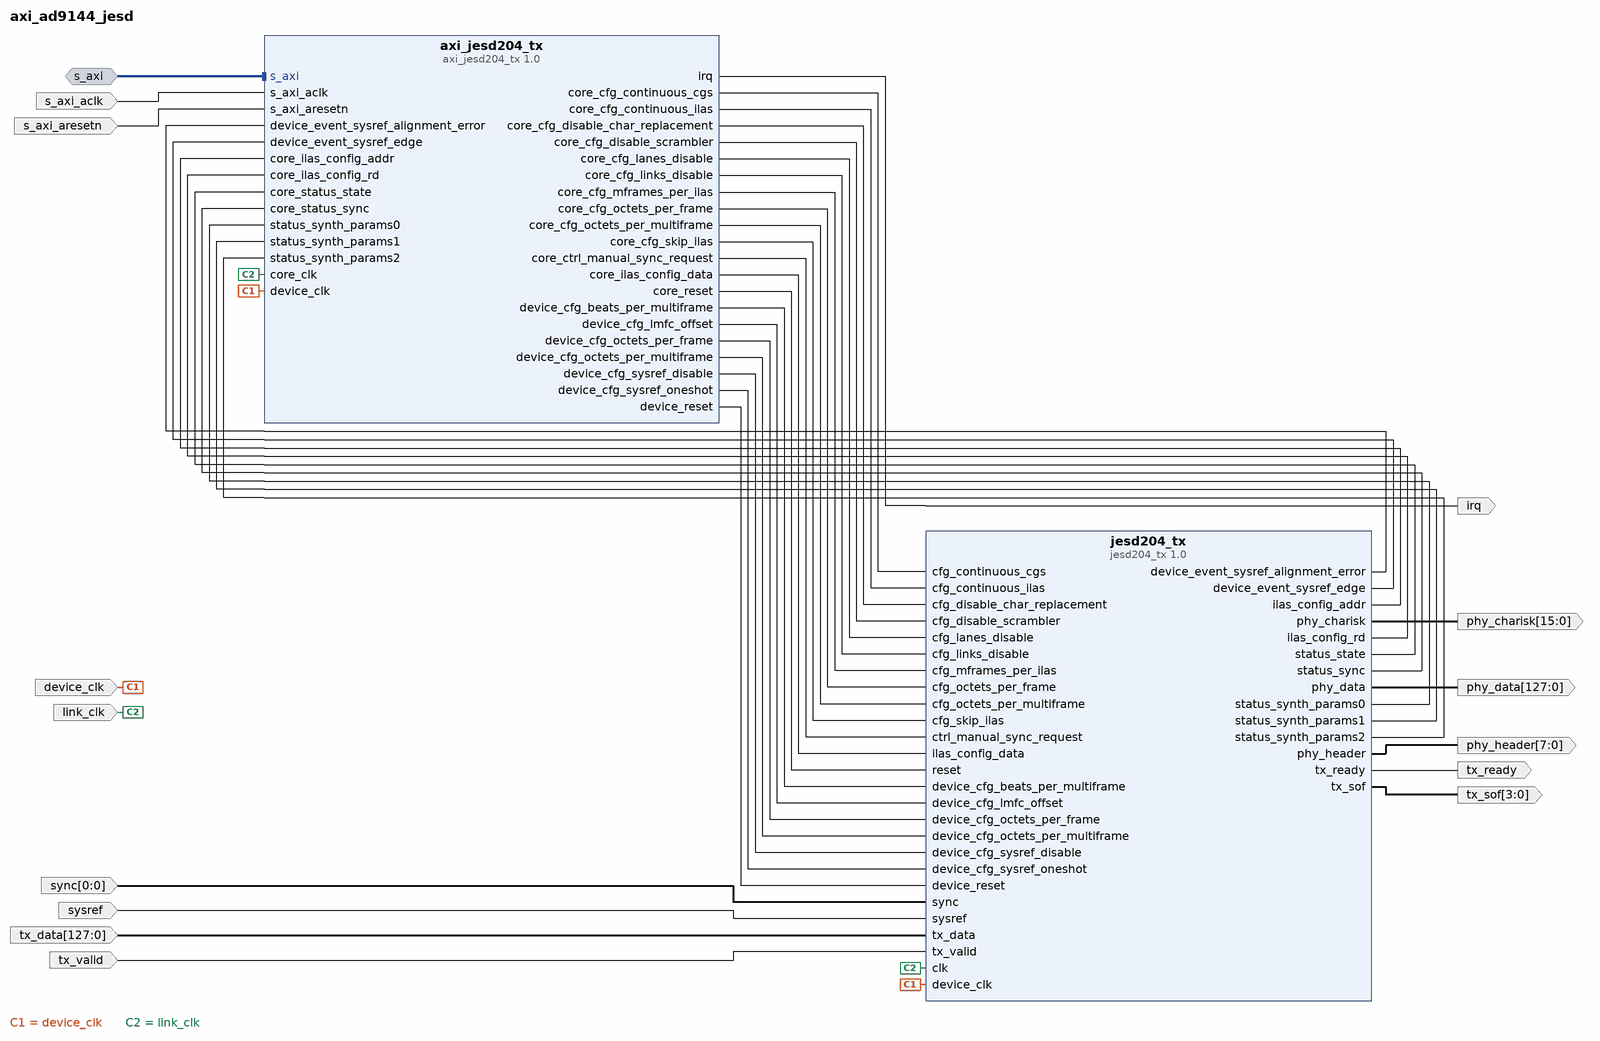
[diagram p0: block diagram of the top level]
# Vivado block design axi_ad9144_jesd, xczu7ev-fbvb900-1-e, Vivado 2022.2
create_bd_design axi_ad9144_jesd

create_bd_intf_port -mode Slave -vlnv xilinx.com:interface:aximm_rtl:1.0 s_axi
set_property -dict [list \
  CONFIG.ADDR_WIDTH 14 \
  CONFIG.ARUSER_WIDTH 0 \
  CONFIG.AWUSER_WIDTH 0 \
  CONFIG.BUSER_WIDTH 0 \
  CONFIG.DATA_WIDTH 32 \
  CONFIG.HAS_BRESP 1 \
  CONFIG.HAS_BURST 0 \
  CONFIG.HAS_CACHE 0 \
  CONFIG.HAS_LOCK 0 \
  CONFIG.HAS_PROT 1 \
  CONFIG.HAS_QOS 0 \
  CONFIG.HAS_REGION 0 \
  CONFIG.HAS_RRESP 1 \
  CONFIG.HAS_WSTRB 1 \
  CONFIG.ID_WIDTH 0 \
  CONFIG.MAX_BURST_LENGTH 1 \
  CONFIG.NUM_READ_OUTSTANDING 1 \
  CONFIG.NUM_READ_THREADS 1 \
  CONFIG.NUM_WRITE_OUTSTANDING 1 \
  CONFIG.NUM_WRITE_THREADS 1 \
  CONFIG.PROTOCOL AXI4LITE \
  CONFIG.READ_WRITE_MODE READ_WRITE \
  CONFIG.RUSER_BITS_PER_BYTE 0 \
  CONFIG.RUSER_WIDTH 0 \
  CONFIG.SUPPORTS_NARROW_BURST 0 \
  CONFIG.WUSER_BITS_PER_BYTE 0 \
  CONFIG.WUSER_WIDTH 0 \
] [get_bd_intf_ports s_axi]
create_bd_port -dir I -type clk s_axi_aclk
set_property -dict {CONFIG.FREQ_HZ 100000000} [get_bd_ports s_axi_aclk]
create_bd_port -dir I -type rst s_axi_aresetn
create_bd_port -dir I -type clk link_clk
set_property -dict {CONFIG.FREQ_HZ 100000000} [get_bd_ports link_clk]
create_bd_port -dir I -type clk device_clk
set_property -dict {CONFIG.FREQ_HZ 100000000} [get_bd_ports device_clk]
create_bd_port -dir I -from 0 -to 0 sync
create_bd_port -dir I sysref
create_bd_port -dir O -type intr irq
create_bd_port -dir I tx_valid
create_bd_port -dir I -from 127 -to 0 tx_data
create_bd_port -dir O -from 127 -to 0 phy_data
create_bd_port -dir O -from 15 -to 0 phy_charisk
create_bd_port -dir O -from 7 -to 0 phy_header
create_bd_port -dir O tx_ready
create_bd_port -dir O -from 3 -to 0 tx_sof

create_bd_cell -type ip -vlnv analog.devices:user:axi_jesd204_tx:1.0 axi_jesd204_tx
set_property -dict {CONFIG.NUM_LANES 4} [get_bd_cells axi_jesd204_tx]
create_bd_cell -type ip -vlnv analog.devices:user:jesd204_tx:1.0 jesd204_tx
set_property -dict {CONFIG.ASYNC_CLK 0 CONFIG.NUM_LANES 4} [get_bd_cells jesd204_tx]

# ---- connections ----

connect_bd_intf_net [get_bd_intf_ports s_axi] [get_bd_intf_pins axi_jesd204_tx/s_axi]
connect_bd_net [get_bd_pins axi_jesd204_tx/core_cfg_continuous_cgs] [get_bd_pins jesd204_tx/cfg_continuous_cgs]
connect_bd_net [get_bd_pins axi_jesd204_tx/core_cfg_continuous_ilas] [get_bd_pins jesd204_tx/cfg_continuous_ilas]
connect_bd_net [get_bd_pins axi_jesd204_tx/core_cfg_disable_char_replacement] [get_bd_pins jesd204_tx/cfg_disable_char_replacement]
connect_bd_net [get_bd_pins axi_jesd204_tx/core_cfg_disable_scrambler] [get_bd_pins jesd204_tx/cfg_disable_scrambler]
connect_bd_net [get_bd_pins axi_jesd204_tx/core_cfg_lanes_disable] [get_bd_pins jesd204_tx/cfg_lanes_disable]
connect_bd_net [get_bd_pins axi_jesd204_tx/core_cfg_links_disable] [get_bd_pins jesd204_tx/cfg_links_disable]
connect_bd_net [get_bd_pins axi_jesd204_tx/core_cfg_mframes_per_ilas] [get_bd_pins jesd204_tx/cfg_mframes_per_ilas]
connect_bd_net [get_bd_pins axi_jesd204_tx/core_cfg_octets_per_frame] [get_bd_pins jesd204_tx/cfg_octets_per_frame]
connect_bd_net [get_bd_pins axi_jesd204_tx/core_cfg_octets_per_multiframe] [get_bd_pins jesd204_tx/cfg_octets_per_multiframe]
connect_bd_net [get_bd_pins axi_jesd204_tx/core_cfg_skip_ilas] [get_bd_pins jesd204_tx/cfg_skip_ilas]
connect_bd_net [get_bd_pins axi_jesd204_tx/core_ctrl_manual_sync_request] [get_bd_pins jesd204_tx/ctrl_manual_sync_request]
connect_bd_net [get_bd_pins axi_jesd204_tx/core_ilas_config_data] [get_bd_pins jesd204_tx/ilas_config_data]
connect_bd_net [get_bd_pins axi_jesd204_tx/core_reset] [get_bd_pins jesd204_tx/reset]
connect_bd_net [get_bd_pins axi_jesd204_tx/device_cfg_beats_per_multiframe] [get_bd_pins jesd204_tx/device_cfg_beats_per_multiframe]
connect_bd_net [get_bd_pins axi_jesd204_tx/device_cfg_lmfc_offset] [get_bd_pins jesd204_tx/device_cfg_lmfc_offset]
connect_bd_net [get_bd_pins axi_jesd204_tx/device_cfg_octets_per_frame] [get_bd_pins jesd204_tx/device_cfg_octets_per_frame]
connect_bd_net [get_bd_pins axi_jesd204_tx/device_cfg_octets_per_multiframe] [get_bd_pins jesd204_tx/device_cfg_octets_per_multiframe]
connect_bd_net [get_bd_pins axi_jesd204_tx/device_cfg_sysref_disable] [get_bd_pins jesd204_tx/device_cfg_sysref_disable]
connect_bd_net [get_bd_pins axi_jesd204_tx/device_cfg_sysref_oneshot] [get_bd_pins jesd204_tx/device_cfg_sysref_oneshot]
connect_bd_net [get_bd_pins axi_jesd204_tx/device_reset] [get_bd_pins jesd204_tx/device_reset]
connect_bd_net [get_bd_pins axi_jesd204_tx/irq] [get_bd_ports irq]
connect_bd_net [get_bd_ports device_clk] [get_bd_pins axi_jesd204_tx/device_clk] [get_bd_pins jesd204_tx/device_clk]
connect_bd_net [get_bd_pins jesd204_tx/device_event_sysref_alignment_error] [get_bd_pins axi_jesd204_tx/device_event_sysref_alignment_error]
connect_bd_net [get_bd_pins jesd204_tx/device_event_sysref_edge] [get_bd_pins axi_jesd204_tx/device_event_sysref_edge]
connect_bd_net [get_bd_pins jesd204_tx/ilas_config_addr] [get_bd_pins axi_jesd204_tx/core_ilas_config_addr]
connect_bd_net [get_bd_pins jesd204_tx/ilas_config_rd] [get_bd_pins axi_jesd204_tx/core_ilas_config_rd]
connect_bd_net [get_bd_pins jesd204_tx/phy_charisk] [get_bd_ports phy_charisk]
connect_bd_net [get_bd_pins jesd204_tx/phy_data] [get_bd_ports phy_data]
connect_bd_net [get_bd_pins jesd204_tx/phy_header] [get_bd_ports phy_header]
connect_bd_net [get_bd_pins jesd204_tx/status_state] [get_bd_pins axi_jesd204_tx/core_status_state]
connect_bd_net [get_bd_pins jesd204_tx/status_sync] [get_bd_pins axi_jesd204_tx/core_status_sync]
connect_bd_net [get_bd_pins jesd204_tx/status_synth_params0] [get_bd_pins axi_jesd204_tx/status_synth_params0]
connect_bd_net [get_bd_pins jesd204_tx/status_synth_params1] [get_bd_pins axi_jesd204_tx/status_synth_params1]
connect_bd_net [get_bd_pins jesd204_tx/status_synth_params2] [get_bd_pins axi_jesd204_tx/status_synth_params2]
connect_bd_net [get_bd_pins jesd204_tx/tx_ready] [get_bd_ports tx_ready]
connect_bd_net [get_bd_pins jesd204_tx/tx_sof] [get_bd_ports tx_sof]
connect_bd_net [get_bd_ports link_clk] [get_bd_pins axi_jesd204_tx/core_clk] [get_bd_pins jesd204_tx/clk]
connect_bd_net [get_bd_ports s_axi_aclk] [get_bd_pins axi_jesd204_tx/s_axi_aclk]
connect_bd_net [get_bd_ports s_axi_aresetn] [get_bd_pins axi_jesd204_tx/s_axi_aresetn]
connect_bd_net [get_bd_ports sync] [get_bd_pins jesd204_tx/sync]
connect_bd_net [get_bd_ports sysref] [get_bd_pins jesd204_tx/sysref]
connect_bd_net [get_bd_ports tx_data] [get_bd_pins jesd204_tx/tx_data]
connect_bd_net [get_bd_ports tx_valid] [get_bd_pins jesd204_tx/tx_valid]

validate_bd_design
save_bd_design
